# EAGLE design cover_pcb_2 (EAGLE 9.3.1)

## Sheet 1 of 2
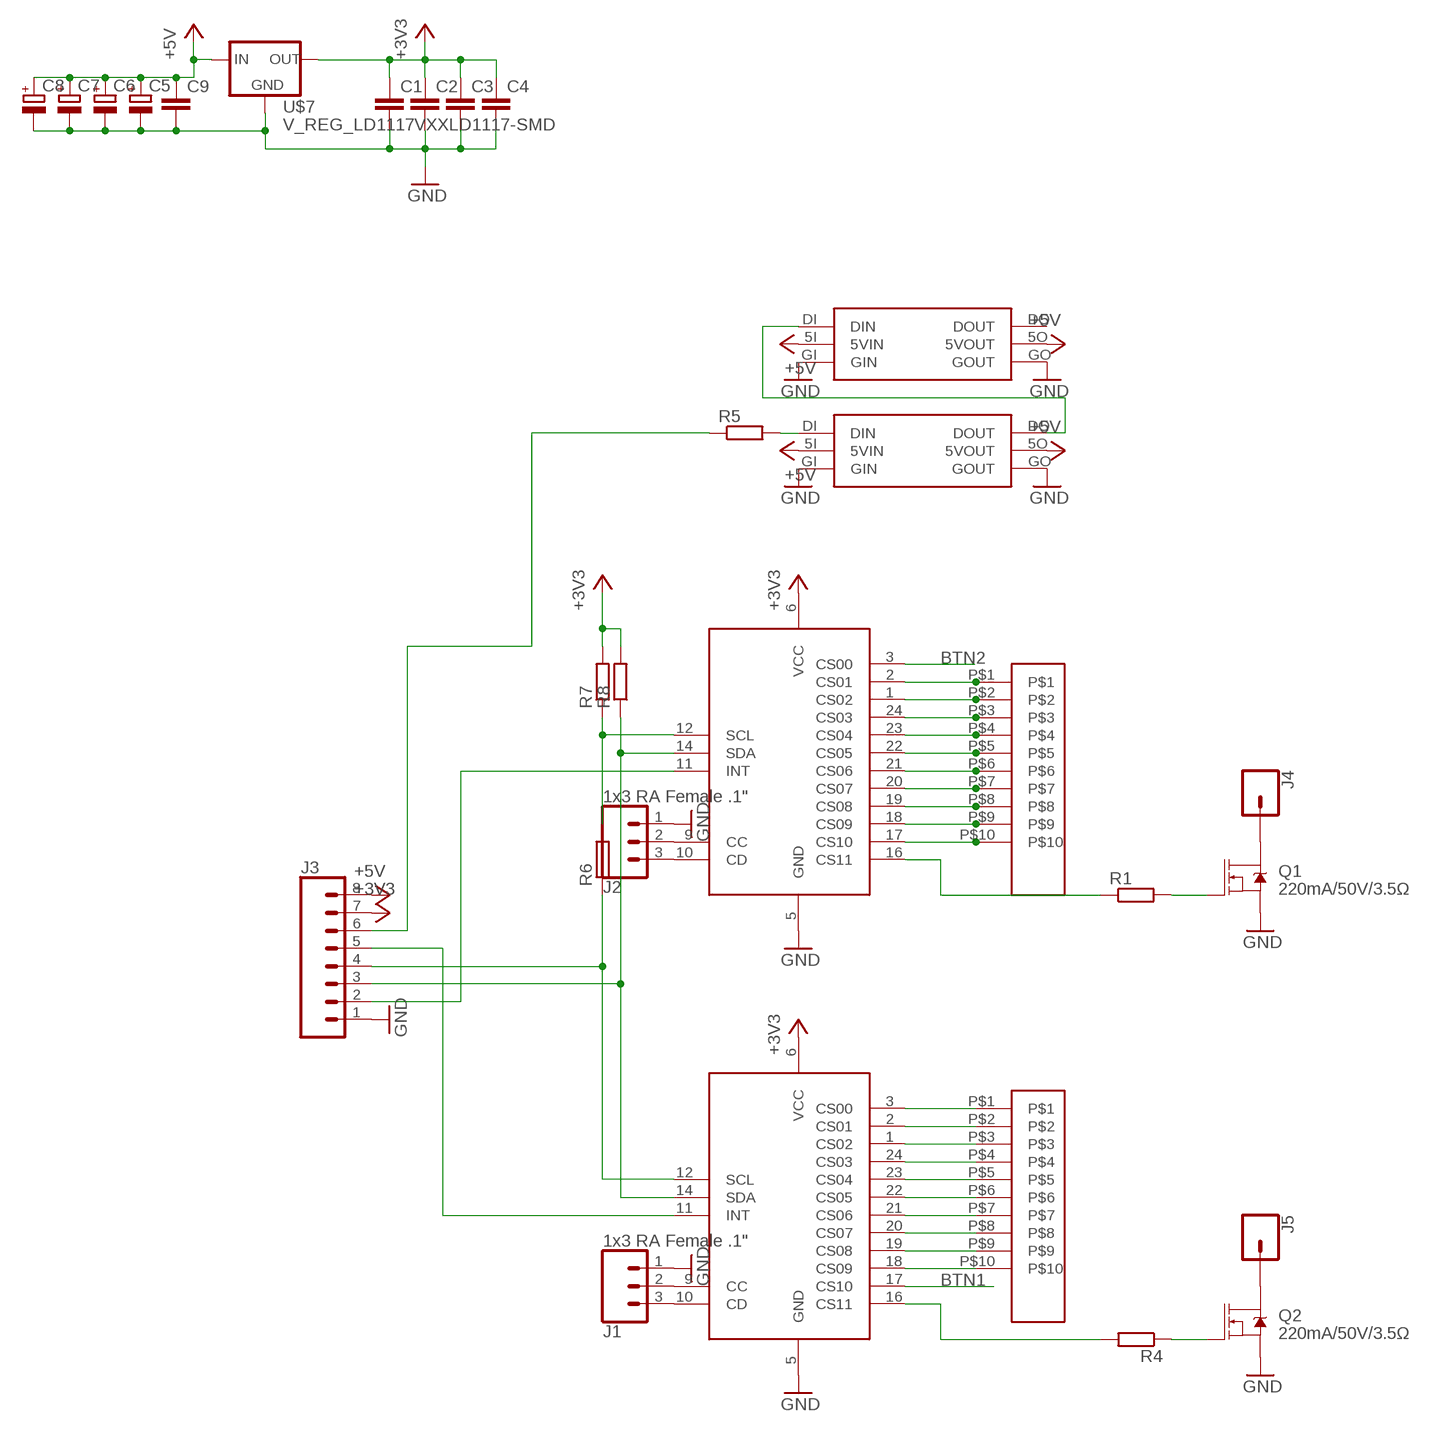
[diagram p0: schematic, sheet 1]

### Parts
C1  C-EUC0805K  [C0805K]
C2  C-EUC0805K  [C0805K]
C3  C-EUC0805K  [C0805K]
C4  C-EUC0805K  [C0805K]
C5  CPOL-EUSMCD  [SMC_D]
C6  CPOL-EUSMCD  [SMC_D]
C7  CPOL-EUSMCD  [SMC_D]
C8  CPOL-EUSMCD  [SMC_D]
C9  C-EUC0805K  [C0805K]
J1  1x3 RA Female .1"  CONN_03SMD_RA_FEMALE  [1X03_SMD_RA_FEMALE]
J2  1x3 RA Female .1"  CONN_03SMD_RA_FEMALE  [1X03_SMD_RA_FEMALE]
J3  CONN_08SMD-MALE  [1X08_SMD_MALE]
J4  CONN_01SPRING-CONN  [SPRING-CONNECTOR]
J5  CONN_01SPRING-CONN  [SPRING-CONNECTOR]
Q1  220mA/50V/3.5Ω  MOSFET-NCH-BSS138  [SOT23-3]
Q2  220mA/50V/3.5Ω  MOSFET-NCH-BSS138  [SOT23-3]
R1  R-EU_R0805  [R0805]
R4  R-EU_R0805  [R0805]
R5  R-EU_R0805  [R0805]
R6  R-EU_R0805  [R0805]
R7  R-EU_R0805  [R0805]
R8  R-EU_R0805  [R0805]
U$1  RGB6LED  [RGB6LED]
U$2  RGB6LED  [RGB6LED]
U$3  TOUCH10  [TOUCH10CM]
U$4  TOUCH10  [TOUCH10CM]
U$5  CP112S  [QSOP24]
U$6  CP112S  [QSOP24]
U$7  V_REG_LD1117VXXLD1117-SMD  [SOT223]

### Nets
+3V3: C1.1 C2.1 C3.1 C4.1 J3.7 R7.2 R8.2 U$5.6(VCC) U$6.6(VCC) U$7.2(OUT)
+5V: C5.+ C6.+ C7.+ C8.+ C9.1 J3.8 U$1.5I(5VIN) U$1.5O(5VOUT) U$2.5I(5VIN) U$2.5O(5VOUT) U$7.3(IN)
BTN1: U$6.17(CS10)
BTN2: U$5.3(CS00)
GND: C1.2 C2.2 C3.2 C4.2 C5.- C6.- C7.- C8.- C9.2 J1.1 J2.1 J3.1 Q1.2(S) Q2.2(S) U$1.GI(GIN) U$1.GO(GOUT) U$2.GI(GIN) U$2.GO(GOUT) U$5.5(GND) U$6.5(GND) U$7.1(GND) ; also sheet 2
N$2: U$3.P$1 U$5.2(CS01)
N$3: U$3.P$2 U$5.1(CS02)
N$4: U$3.P$3 U$5.24(CS03)
N$5: U$3.P$4 U$5.23(CS04)
N$6: U$3.P$5 U$5.22(CS05)
N$7: U$3.P$6 U$5.21(CS06)
N$8: U$3.P$7 U$5.20(CS07)
N$9: U$3.P$8 U$5.19(CS08)
N$10: U$3.P$9 U$5.18(CS09)
N$11: U$4.P$1 U$6.3(CS00)
N$12: U$4.P$2 U$6.2(CS01)
N$13: U$4.P$3 U$6.1(CS02)
N$14: U$4.P$4 U$6.24(CS03)
N$15: U$4.P$5 U$6.23(CS04)
N$16: U$4.P$6 U$6.22(CS05)
N$17: U$4.P$7 U$6.21(CS06)
N$18: U$4.P$8 U$6.20(CS07)
N$19: U$4.P$9 U$6.19(CS08)
N$20: U$4.P$10 U$6.18(CS09)
N$21: R6.2 R7.1 U$5.12(SCL)
N$22: J3.5 U$6.11(INT)
N$24: U$1.DI(DIN) U$2.DO(DOUT)
N$25: R1.1 U$5.16(CS11)
N$26: R4.2 U$6.16(CS11)
N$27: Q2.1(G) R4.1
N$28: J5.P$2 Q2.3(D)
N$29: R5.2 U$2.DI(DIN)
N$30: J3.6 R5.1
N$31: J3.3 R8.1 U$5.14(SDA) U$6.14(SDA)
N$32: J3.4 R6.1 U$6.12(SCL)
N$34: J3.2 U$5.11(INT)
N$35: J4.P$2 Q1.3(D)
N$36: J2.2 U$5.9(CC)
N$37: J2.3 U$5.10(CD)
N$38: J1.2 U$6.9(CC)
N$39: J1.3 U$6.10(CD)
N$40: Q1.1(G) R1.2
T1: U$3.P$10 U$5.17(CS10)
Unconnected: U$1.DO(DOUT)

## Sheet 2 of 2
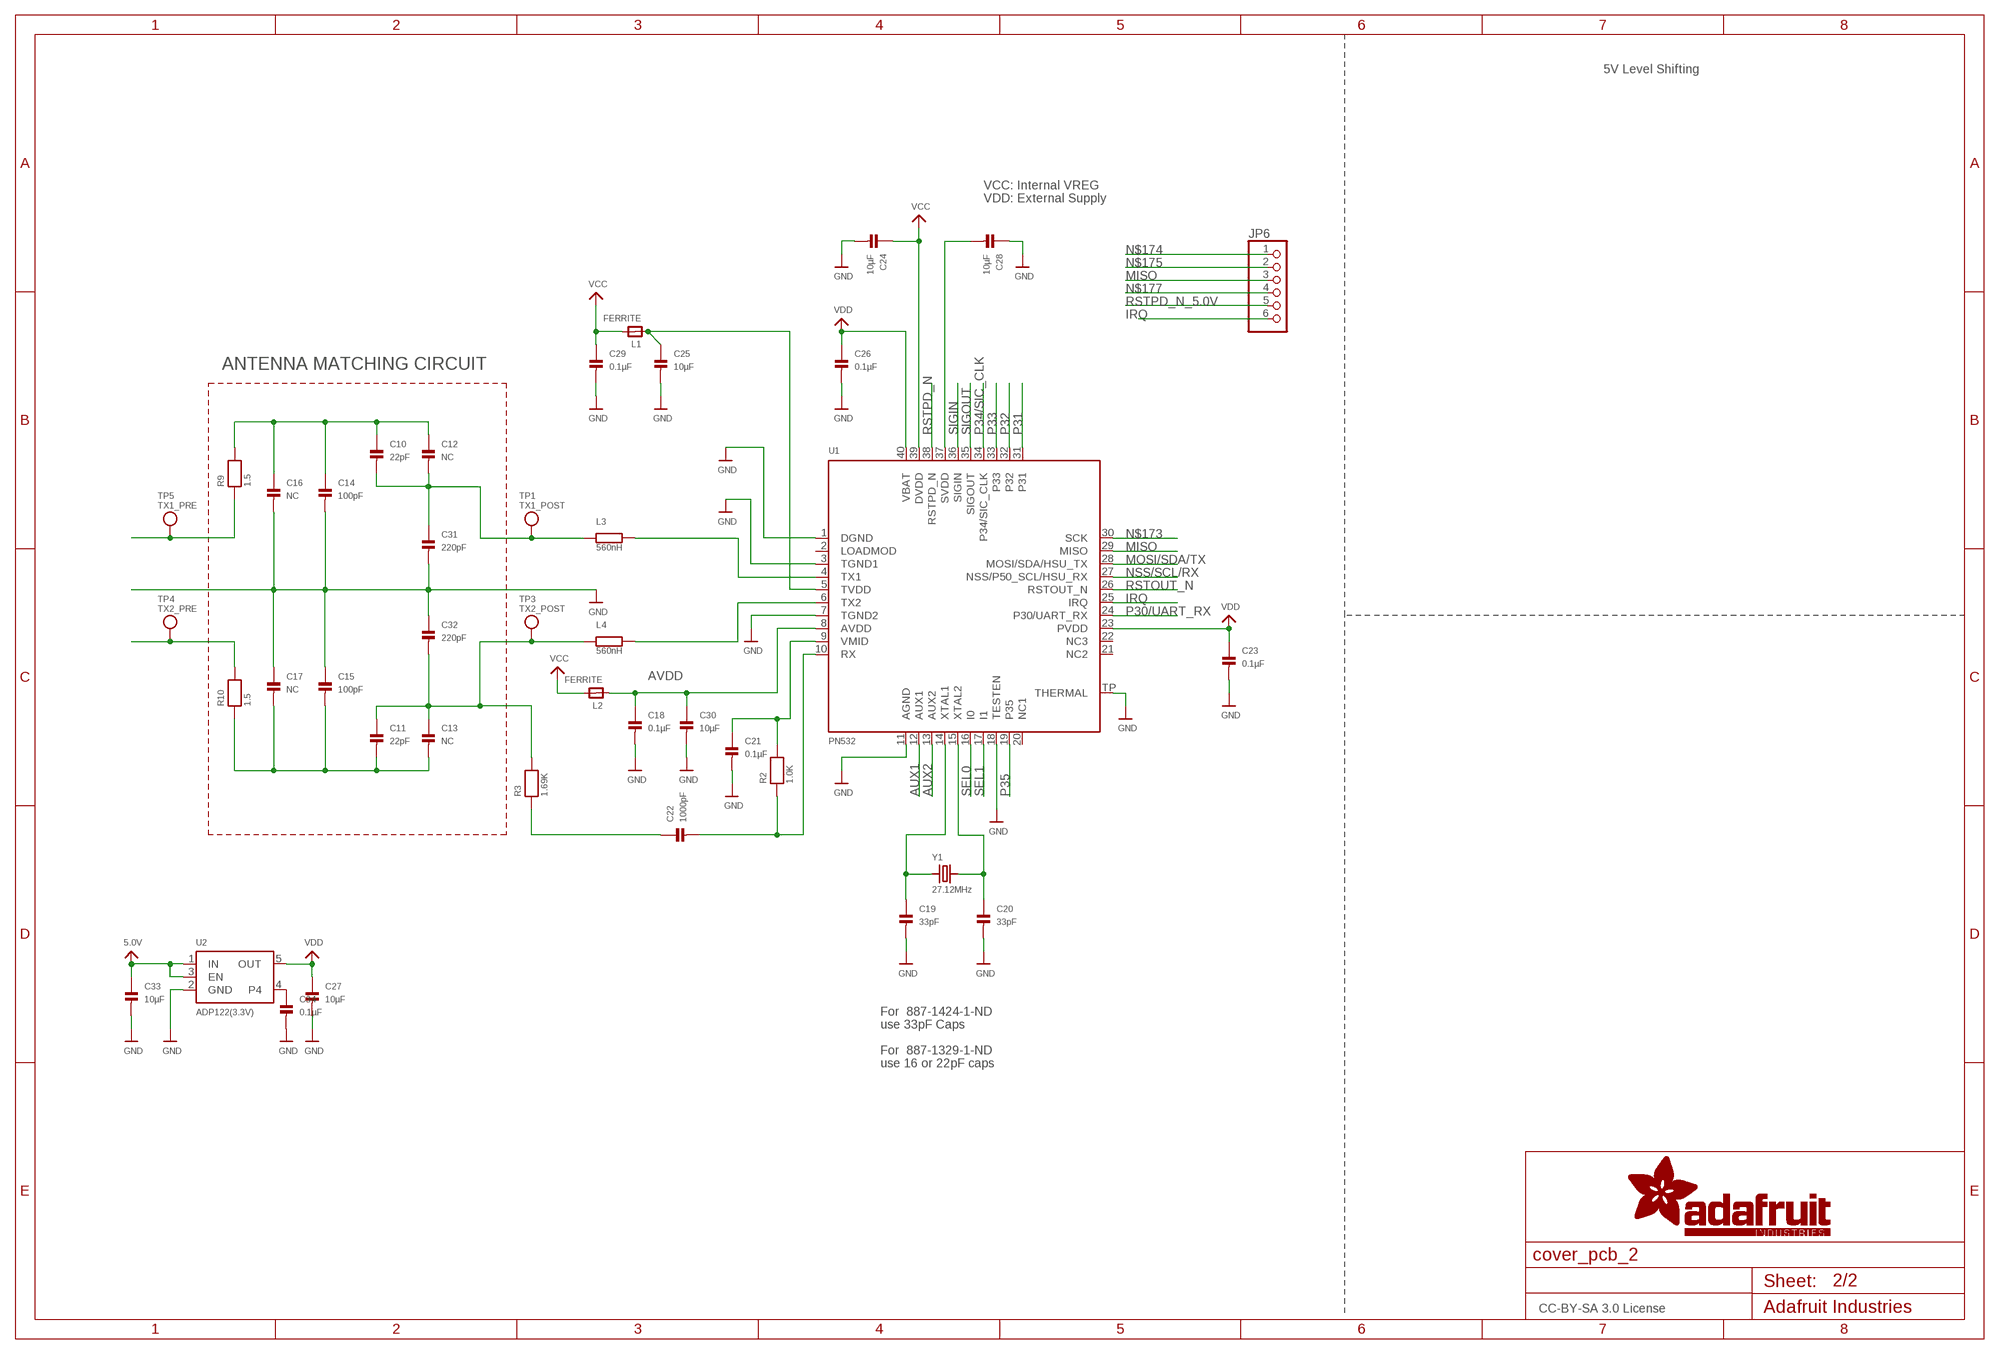
[diagram p1: schematic, sheet 2]

### Parts
C10  22pF  CAP_CERAMIC0805  [0805]
C11  22pF  CAP_CERAMIC0805  [0805]
C12  NC  CAP_CERAMIC0805  [0805]
C13  NC  CAP_CERAMIC0805  [0805]
C14  100pF  CAP_CERAMIC0805  [0805]
C15  100pF  CAP_CERAMIC0805  [0805]
C16  NC  CAP_CERAMIC0805  [0805]
C17  NC  CAP_CERAMIC0805  [0805]
C18  0.1µF  CAP_CERAMIC0805  [0805]
C19  33pF  CAP_CERAMIC0805  [0805]
C20  33pF  CAP_CERAMIC0805  [0805]
C21  0.1µF  CAP_CERAMIC0805  [0805]
C22  1000pF  CAP_CERAMIC0805  [0805]
C23  0.1µF  CAP_CERAMIC0805  [0805]
C24  10µF  CAP_CERAMIC0805  [0805]
C25  10µF  CAP_CERAMIC0805  [0805]
C26  0.1µF  CAP_CERAMIC0805  [0805]
C27  10µF  CAP_CERAMIC0805  [0805]
C28  10µF  CAP_CERAMIC0805  [0805]
C29  0.1µF  CAP_CERAMIC0805  [0805]
C30  10µF  CAP_CERAMIC0805  [0805]
C31  220pF  CAP_CERAMIC0805  [0805]
C32  220pF  CAP_CERAMIC0805  [0805]
C33  10µF  CAP_CERAMIC0805  [0805]
C34  0.1µF  CAP_CERAMIC0805  [0805]
JP6  PINHD-1X6B  [1X06-BIG]
L1  FERRITE  FERRITE0805  [0805]
L2  FERRITE  FERRITE0805  [0805]
L3  560nH  R-EU_R1206  [R1206]
L4  560nH  R-EU_R1206  [R1206]
R2  1.0K  RESISTOR0805  [0805]
R3  1.69K  RESISTOR0805  [0805]
R9  1.5  RESISTOR0805  [0805]
R10  1.5  RESISTOR0805  [0805]
TP1  TX1_POST  TESTPOINTPAD  [TESTPOINT_PAD_2MM]
TP3  TX2_POST  TESTPOINTPAD  [TESTPOINT_PAD_2MM]
TP4  TX2_PRE  TESTPOINTPAD  [TESTPOINT_PAD_2MM]
TP5  TX1_PRE  TESTPOINTPAD  [TESTPOINT_PAD_2MM]
U1  PN532  [HVQFN40-6X6]
U2  ADP122(3.3V)  VREG_SOT23-5  [SOT23-5]
Y1  27.12MHz  CRYSTAL3.2X2.5  [CRYSTAL_3.2X2.5]

### Nets
5.0V: C33.1 U2.1(IN) U2.3(EN)
AUX1: U1.12(AUX1)
AUX2: U1.13(AUX2)
AVDD: C18.1 C30.1 L2.1 U1.8(AVDD)
GND: C14.2 C15.1 C16.2 C17.1 C18.2 C19.2 C20.2 C21.2 C23.2 C24.2 C25.2 C26.2 C27.2 C28.1 C29.2 C30.2 C31.2 C32.1 C33.2 C34.2 U1.1(DGND) U1.3(TGND1) U1.7(TGND2) U1.11(AGND) U1.18(TESTEN) U1.TP(THERMAL) U2.2(GND) ; also sheet 1
IRQ: JP6.6 U1.25(IRQ)
MISO: JP6.3 U1.29(MISO)
MOSI/SDA/TX: U1.28(MOSI/SDA/HSU_TX)
N$44: L3.2 U1.4(TX1)
N$45: L4.2 U1.6(TX2)
N$46: C10.2 C12.2 C31.1 L3.1 TP1.P$1
N$47: C19.1 U1.14(XTAL1) Y1.1
N$48: C20.1 U1.15(XTAL2) Y1.2
N$49: C21.1 R2.2 U1.9(VMID)
N$50: C22.2 R2.1 U1.10(RX)
N$51: C22.1 R3.1
N$52: C11.1 C13.1 C32.2 L4.1 R3.2 TP3.P$1
N$53: R9.1 TP5.P$1
N$54: R10.2 TP4.P$1
N$56: C25.1 L1.1 U1.5(TVDD)
N$83: C34.1 U2.4
N$84: C28.2 U1.37(SVDD)
N$173: U1.30(SCK)
N$174: JP6.1
N$175: JP6.2
N$177: JP6.4
NSS/SCL/RX: U1.27(NSS/P50_SCL/HSU_RX)
P30/UART_RX: U1.24(P30/UART_RX)
P31: U1.31
P32: U1.32
P33: U1.33
P34/SIC_CLK: U1.34(P34/SIC_CLK)
P35: U1.19(P35)
RSTOUT_N: U1.26(RSTOUT_N)
RSTPD_N: U1.38(RSTPD_N)
RSTPD_N_5.0V: JP6.5
SEL0: U1.16(I0)
SEL1: U1.17(I1)
SIGIN: U1.36(SIGIN)
SIGOUT: U1.35(SIGOUT)
TX1_ANTENNA: C10.1 C12.1 C14.1 C16.1 R9.2
TX2_ANTENNA: C11.2 C13.2 C15.2 C17.2 R10.1
VCC: C24.1 C29.1 L1.2 L2.2 U1.39(DVDD)
VDD: C23.1 C26.1 C27.1 U1.23(PVDD) U1.40(VBAT) U2.5(OUT)
Unconnected: U1.2(LOADMOD) U1.20(NC1) U1.21(NC2) U1.22(NC3)

### Notes on the sheet
- 5V Level Shifting
- VCC: Internal VREG
- VDD: External Supply
- ANTENNA MATCHING CIRCUIT
- For  887-1424-1-ND
- use 33pF Caps
- For  887-1329-1-ND
- use 16 or 22pF caps
- CC-BY-SA 3.0 License

## Library data of the parts
C1-C4 C9 = rcl:C-EU: CAPACITOR, European symbol; SPICEPREFIX: C
C5-C8 = rcl:CPOL-EU: POLARIZED CAPACITOR, European symbol; SPICEPREFIX: C
C10-C34 = microbuilder:CAP_CERAMIC: Ceramic Capacitors 0402 - 0402 Surface Mount Capacitors 16pF 50V 5% [Digikey: 445-4899-2-ND] 18pF 50V 5% [Digikey: 490-1281-2-ND] 22pF 50V 5% [Digikey: 490-1283-2-ND] 68pF 50V 5% [Digikey: 490-1289-2-ND] 0.1uF 10V 10% [Digikey: 490-1318-2-ND] 1.0uF 6.3V 10% [Digikey: 490-1320-2-ND] 0603 - 0603 Surface Mount Capacitors 16 pF 50V 5% [Digikey: 445-5051-2-ND] 22 pF 50V [Digikey: PCC220ACVTR-ND] 33 pF 50V 5% [Digikey: 490-1415-1-ND] 56pF 50V 5% [Digikey: 490-1421-1-ND] 220pF 50V 5% [Digikey: 445-1285-1-ND] 680 pF 50V 2200 pF 50V 5% C0G [Digikey: 445-1297-1-ND] 5600 pF 100V 5% X7R [Digikey: 478-3711-1-ND] 0.1 µF 25V 10% [Digikey: PCC2277TR-ND] 0.22 µF 16V 10% X7R [Digikey: 445-1318-1-ND] 1.0 µF 25V 10% [Digikey: 445-5146-2-ND] 0603 - RF Specific 3pF 250V +/-0.1pF RF [Digikey: 712-1347-1-ND] 18 pF 250V 5% [Digikey: 478-3505-1-ND or 712-1322-1-ND] 56 pF 250V 5% C0G RF [Digikey: 490-4867-1-ND] 68 pF 250V RF [Digikey: 490-4868-1-ND] 0805 - 0805 Surface Mount Capacitors 220 pF 250V 2% RF Ceramic Capacitor [Digikey: 712-1398-1-ND] 1000 pF 50V 2% NP0 Ceramic Capacitor [Digikey: 478-3760-1-ND] 0.1 µF 25V 10% Ceramic Capacitor [Digikey: PCC1828TR-ND] 1.0 µF 16V 10% Ceramic Capacitor[Digikey: 490-1691-2-ND] 10.0 µF 10V 10% Ceramic Capacitor[Digikey: 709-1228-1-ND] 10.0 uF 16V 10% Ceramic Capacitor [Digikey: 478-5165-2-ND] 47 uF 6.3V 20% Ceramic Capacitor [Digikey: 587-1779-1-ND or 399-5506-1-ND] 1206 - 1206 Surface Mount Capacitors 47uF 10V 20% Ceramic Capacitor [Digikey: 490-5528-1-ND or 399-5508-1-ND or 445-6010-1-ND] 100uF 6.3V -20%, +80% Y5V Ceramic Capacitor (Digikey: 490-4512-1-ND, Mouser: 81-GRM31CF50J107ZE1L)
J1 J2 = SparkFun-Connectors:CONN_03: Multi connection point. Often used as Generic Header-pin footprint for 0.1 inch spaced/style header connections On any of the 0.1 inch spaced packages, you can populate with these: Break Away Headers - Straight <https://www.sparkfun.com/products/116> (PRT-00116) Break Away Male Headers - Right Angle <https://www.sparkfun.com/products/553> (PRT-00553) Female Headers <https://www.sparkfun.com/products/115> (PRT-00115) Break Away Headers - Machine Pin <https://www.sparkfun.com/products/117> (PRT-00117) Break Away Female Headers - Swiss Machine Pin <https://www.sparkfun.com/products/743> (PRT-00743) Stackable Header - 3 Pin (Female, 0.1") <https://www.sparkfun.com/products/13875> (PRT-13875) For SCREWTERMINALS and SPRING TERMINALS visit here: Screw Terimnals on SparkFun.com <https://www.sparkfun.com/search/results?term=Screw+Terminals> (5mm/3.5mm/2.54mm spacing) This device is also useful as a general connection point to wire up your design to another part of your project. Our various solder wires solder well into these plated through hole pads. Hook-Up Wire - Assortment (Stranded, 22 AWG) <https://www.sparkfun.com/products/11375> (PRT-11375) Hook-Up Wire - Assortment (Solid Core, 22 AWG) <https://www.sparkfun.com/products/11367> (PRT-11367) View the entire wire category on our website here <https://www.sparkfun.com/categories/141> Special notes: Molex polarized connector foot print use with SKU : PRT-08232 with associated crimp pins and housings.; PROD_ID: CONN-10926
J3 = SparkFun-Connectors:CONN_08: Multi connection point. Often used as Generic Header-pin footprint for 0.1 inch spaced/style header connections On any of the 0.1 inch spaced packages, you can populate with these: Break Away Headers - Straight <https://www.sparkfun.com/products/116> (PRT-00116) Break Away Male Headers - Right Angle <https://www.sparkfun.com/products/553> (PRT-00553) Female Headers <https://www.sparkfun.com/products/115> (PRT-00115) Break Away Headers - Machine Pin <https://www.sparkfun.com/products/117> (PRT-00117) Break Away Female Headers - Swiss Machine Pin <https://www.sparkfun.com/products/743> (PRT-00743) Arduino Stackable Header - 8 Pin <https://www.sparkfun.com/products/9279> (PRT-09279) For SCREWTERMINALS and SPRING TERMINALS visit here: Screw Terimnals on SparkFun.com <https://www.sparkfun.com/search/results?term=Screw+Terminals> (5mm/3.5mm/2.54mm spacing) This device is also useful as a general connection point to wire up your design to another part of your project. Our various solder wires solder well into these plated through hole pads. Hook-Up Wire - Assortment (Stranded, 22 AWG) <https://www.sparkfun.com/products/11375> (PRT-11375) Hook-Up Wire - Assortment (Solid Core, 22 AWG) <https://www.sparkfun.com/products/11367> (PRT-11367) View the entire wire category on our website here <https://www.sparkfun.com/categories/141> Special notes: Molex polarized connector foot print use with SKU : PRT-08231 with associated crimp pins and housings. 1MM SMD Version SKU: PRT-10208 NOTES ON THE VARIANTS LOCK and LOCK_LONGPADS... This footprint was designed to help hold the alignment of a through-hole component (i.e. 6-pin header) while soldering it into place. You may notice that each hole has been shifted either up or down by 0.005 of an inch from it's more standard position (which is a perfectly straight line). This slight alteration caused the pins (the squares in the middle) to touch the edges of the holes. Because they are alternating, it causes a "brace" to hold the component in place. 0.005 has proven to be the perfect amount of "off-center" position when using our standard breakaway headers. Although looks a little odd when you look at the bare footprint, once you have a header in there, the alteration is very hard to notice. Also,if you push a header all the way into place, it is covered up entirely on the bottom side.; PROD_ID: CONN-11292; SF_ID: PRT-11541
J4 J5 = SparkFun-Connectors:CONN_01: Single connection point. Often used as Generic Header-pin footprint for 0.1 inch spaced/style header connections On any of the 0.1 inch spaced packages, you can populate with these: Break Away Headers - Straight <https://www.sparkfun.com/products/116> (PRT-00116) Break Away Male Headers - Right Angle <https://www.sparkfun.com/products/553> (PRT-00553) Female Headers <https://www.sparkfun.com/products/115> (PRT-00115) Break Away Headers - Machine Pin <https://www.sparkfun.com/products/117> (PRT-00117) Break Away Female Headers - Swiss Machine Pin <https://www.sparkfun.com/products/743> (PRT-00743) This device is also useful as a general connection point to wire up your design to another part of your project. Our various solder wires solder well into these plated through hole pads. Hook-Up Wire - Assortment (Stranded, 22 AWG) <https://www.sparkfun.com/products/11375> (PRT-11375) Hook-Up Wire - Assortment (Solid Core, 22 AWG) <https://www.sparkfun.com/products/11367> (PRT-11367) View the entire wire category on our website here <https://www.sparkfun.com/categories/141> Special notes: SMTSO-256-ET is a "flush mount" nut for a 4-40 screw. We mostly use this on specialty testbeds; it is a nice way to connect hardware to your PCB at an adjustable hieght. Also note, the SNAP packages are for using a snappable style connector. We sell a baggie of snaps and they are also used on two LilyPad designs: Snap Assortment - 30 pack (male and female) <https://www.sparkfun.com/products/11347> (DEV-11347) LilyPad Arduino SimpleSnap <https://www.sparkfun.com/products/10941> (DEV-10941) LilyPad SimpleSnap Protoboard <https://www.sparkfun.com/products/10940> (DEV-10940); SF_ID: PRT-11822
JP6 = adafruit:PINHD-1X6: PIN HEADER
L1 L2 = microbuilder:FERRITE: Ferrite Bead 0603 MMZ1608B121C - 120 Ohm @ 100MHz, 600mA, 0.15 Ohm DC Resistance - Digikey: 445-2164-1-ND BK1608HW121-T - 120 Ohm, 600mA Ferrite Chip - Digikey: 587-1876-2-ND 0805 HZ0805B272R-10 - 2.7K Ohm @ 100MHz, 200mA, 0.8 Ohm DC Resistance - Digikey: 240-2504-1-ND (see also Murata BLM21BD272SN1L) MMZ2012Y152B - 1.5K Ohm @ 100MHz, 500mA, 0.4 Ohm DC Resistance - Digikey: 445-1560-1-ND - Mainly for high frequency (80-400MHz) MMZ2012R102A - 1K Ohm @ 100MHz, 500mA, 0.3 Ohm DC Resistance - Digikey: 445-1555-2-ND - More general purpose (10-200MHz)
L3 L4 R1 R4-R8 = rcl:R-EU_: RESISTOR, European symbol; SPICEPREFIX: R
Q1 Q2 = SparkFun-DiscreteSemi:MOSFET-NCH: N-channel MOSFETs Voltage controlled devices that allow control of high current outputs. SparkFun Products: SparkFun OpenScale <https://www.sparkfun.com/products/13261> SparkFun Digital Sandbox <https://www.sparkfun.com/products/12651> SparkFun Monster Moto Shield <https://www.sparkfun.com/products/10182> SparkFun MOSFET Power Controller <https://www.sparkfun.com/products/11214>; PROD_ID: TRANS-00830
R2 R3 R9 R10 = microbuilder:RESISTOR: Resistors 0402 - 0402 Surface Mount Package 22 Ohm 1% 1/16W [Digikey: 311-22.0LRTR-ND] 33 Ohm 5% 1/16W 1.0K 5% 1/16W 1.5K 5% 1/16W 2.0K 1% 1/16W 10.0K 1% 1/16W [Digikey: 311-10.0KLRTR-ND] 10.0K 5% 1/16W [Digikey: RMCF0402JT10K0TR-ND] 12.1K 1% 1/16W [Digikey: 311-22.0LRTR-ND] 100.0K 5% 1/16W 0603 - 0603 Surface Mount Package 0 Ohm 1/10 Watt 1% Resistor 15 Ohm 1/10 Watt 1% Resistor 33 Ohm 1/10 Watt 1% Resistor 49.9 Ohm 1/10 Watt 1% Resistor 100 Ohm 1/10 Watt 1% Resistor 150 Ohm 1/10 Watt 1% Resistor 240 Ohm 1/10 Watt 1% Resistor 390 Ohm 1/10 Watt 1% Resistor 560 Ohm 1/10 Watt 1% Resistor 680 Ohm 1/10 Watt 1% Resistor 750 Ohm 1/10 Watt 1% Resistor 1.0K Ohm 1/10 Watt 1% Resistor 1.5K Ohm 1/10 Watt 1% Resistor 2.0K Ohm 1/10 Watt 1% Resistor 2.2K Ohm 1/10 Watt 1% Resistor 3.3K Ohm 1/10 Watt 1% Resistor 4.7K Ohm 1/10 Watt 1% Resistor 10.0K Ohm 1/10 Watt 1% Resistor 12.0K Ohm 1/10 Watt 1% Resistor 12.1K Ohm 1/10 Watt 1% Resistor 20.0K Ohm 1/10 Watt 1% Resistor 33.0K Ohm 1/10 Watt 1% Resistor 100.0K Ohm 1/10 Watt 1% Resistor 0805 - 0805 Surface Mount Package 0 Ohm 1/8 Watt 1% Resistor 33 Ohm 1/8 Watt 1% Resistor 100 Ohm 1/8 Watt 1% Resistor 150 Ohm 1/8 Watt 1% Resistor 200 Ohm 1/8 Watt 1% Resistor 240 Ohm 1/8 Watt 1% Resistor 330 Ohm 1/8 Watt 1% Resistor 390 Ohm 1/8 Watt 1% Resistor 470 Ohm 1/8 Watt 1% Resistor 1.0K Ohm 1/8 Watt 1% Resistor 1.5K Ohm 1/8 Watt 1% Resistor 2.0K Ohm 1/8 Watt 1% Resistor 4.7K Ohm 1/8 Watt 1% Resistor 5.1K Ohm 1/8 Watt 1% Resistor 5.6K Ohm 1/8 Watt 1% Resistor 10.0K Ohm 1/8 Watt 1% Resistor 22.0K Ohm 1/8 Watt 1% Resistor 33.0K Ohm 1/8 Watt 1% Resistor 100K Ohm 1/8 Watt 1% Resistor 1206 - 1206 Surface Mount Package 2012 - 2010 Surface Mount Package 0.11 Ohm 1/2 Watt 1% Resistor - Digikey: RHM.11UCT-ND
TP1 TP3-TP5 = microbuilder:TESTPOINT: Test Point Various test points for characterisation and PCB testing TESTPOINT_SMT - Compact Surface Mount Test Point [Digikey: 5016KTR-ND]
U1 = microbuilder:PN532: PN532 - Near Field Communication (NFC) controller Highly integrated transceiver module for contactless communication at 13.56 MHz (14443A/MIFARE, FeliCa, I4443B)
U2 = microbuilder:VREG_SOT23-5: SOT23-5 Fixed Voltage Regulators Part Current Out V Out V In V Dropout θJA (°C/W) TJ (°C) Digikey Part No. ADP121 150mA 3.3V 3.4-5.5V 0.09V @ 150mA -- -- ADP121-AUJZ33R7CT-ND ADP121 150mA 3.0V 3.1-5.5V 0.09V @ 150mA -- -- ADP121-AUJZ30R7CT-ND ADP122 300mA 3.3V 3.4-5.5V 0.085V @ 300mA -- -- ADP122AUJZ-3.3-R7CT-ND ADP1712 300mA 3.3V 3.5-5.5V 0.17V @ 300mA -- -- ADP1712AUJZ-3.3-R7TR-ND AP7311 (Low Cost) 150mA 3.3V 3.5-6V 0.15V @ 150mA -- -- AP7311-33WG-7DICT-ND LD39015M18R 150mA 1.8V 1.9V-5.5V 0.08V @ 100mA -- -- 497-6977-1-ND LP2985A-33DBVR 150mA 3.3V 3.3-16V 0.28V @ 150mA 206 150 296-18479-1-ND MCP1824T-3302E/OT 300mA 3.3V 3.5V-6V 0.2V @ 300mA -- -- MCP1824T-3302E/OTCT-ND MIC5205-2.5YM5 TR 150mA 2.5V 2.7-16V 0.165V @ 150mA -- -- 576-1257-2-ND MIC5205-3.0YM5 TR 150mA 3.0V 3.2V-16V 0.165V @ 150mA -- -- 576-1258-2-ND MIC5205-3.3YM5 TR 150mA 3.3V 3.5V-16V 0.165V @ 150mA -- -- 576-1259-2-ND TPS780330220 150mA 3.3V+2.2V 3.6-5.5V 250mV Max -- -- 296-23332-1-ND TDA3663/N1,135 100mA 3.3V 3.5-45V 0.18V @ 50mA -- -- 568-5343-1-ND Max operating temp can be calculated using θJA, TJ (max junction temperature), and power in watts. Set the "Maximum Ambient Temperature" until it reaches TJ ("Max Junction Temperature"), which is the absolute limit for safe use of the regulator: Heat Sink Temperature Calculator <http://www.daycounter.com/Calculators/Heat-Sink-Temperature-Calculator.phtml> For example, With 12V source into a 3.3V LP2985 and a 30mA load, we are dissipating (12V-3.3V) * 0.03A = 0.261W. With a θJA of 206 °C/W, a TJ of 150°C, and 261mW we can safely use the chip without a heat sink up to 75°C (=147.1°C Junction Temperature).
U$1 U$2 = mastrogippo:RGB6LED
U$3 U$4 = mastrogippo:TOUCH10
U$5 U$6 = mastrogippo:CP112S
U$7 = SparkFun-IC-Power:V_REG_LD1117VXX: LD1117VXX voltage regulator. We carry the 3.3V version (COM-00526) in TO-220 package.; PROD_ID: VREG-13917
Y1 = microbuilder:CRYSTAL: Crystals HC49UP - Surface Mount Crystal 4.0MHz 18pF +/-30ppm Surface Mount Crystal [Digikey: 535-9857-1-ND] 12.0 MHz Surface Mount Crystal [Digikey: 535-9869-6-ND] 25.0 MHz Surface Mount Crystal [Digikey: 535-9078-1-ND] 2.5 x 2.0mm - MEMs SMT Crystal 16.0 MHz 10pF 20ppm 2.5 x 2.0mm Crystal [Digikey -40-85°C: 535-10923-1-ND] 3.2 x 2.5mm - MEMs SMT Crystal 12.0 MHz 8pF 15ppm 3.2 x 2.5mm Crystal [Digikey: -10-70°C: 644-1047-1-ND -40-125°C: 644-1128-1-ND] 16.0 MHz 8pF 15ppm 3.2 x 2.5mm Crystal [Digikey: -10-70°C: 644-1049-1-ND -40-125°C: 644-1129-2-ND] 16.0 MHz 10pF 10ppm 3.2 x 2.5mm Crystal [Digikey: 644-1100-1-ND] 27.12 MHz 18pF 30ppm 3.2 x 2.5mm Crystal [Digikey: 887-1424-1-ND] 27.12MHz 10pF 10ppm 3.2 x 2.5mm Crystal [Digikey: 887-1329-1-ND] 4.9 x 1.8mm - MEMs SMT Crystal 32.768 KHz 12.5pF 20ppm 4.9 x 1.8mm Crystal [Digikey: SE2415CT-ND] 8.0 x 3.8mm - Surface Mount Crystal 32.768kHz 12.5pF 20ppm -40°C-85°C [Digikey: 535-9166-2-ND] Cylinder 32.768KHz Cylinder Crystal (2x6mm body) [Ex. Digikey: 300-8341-2-ND]

## Board
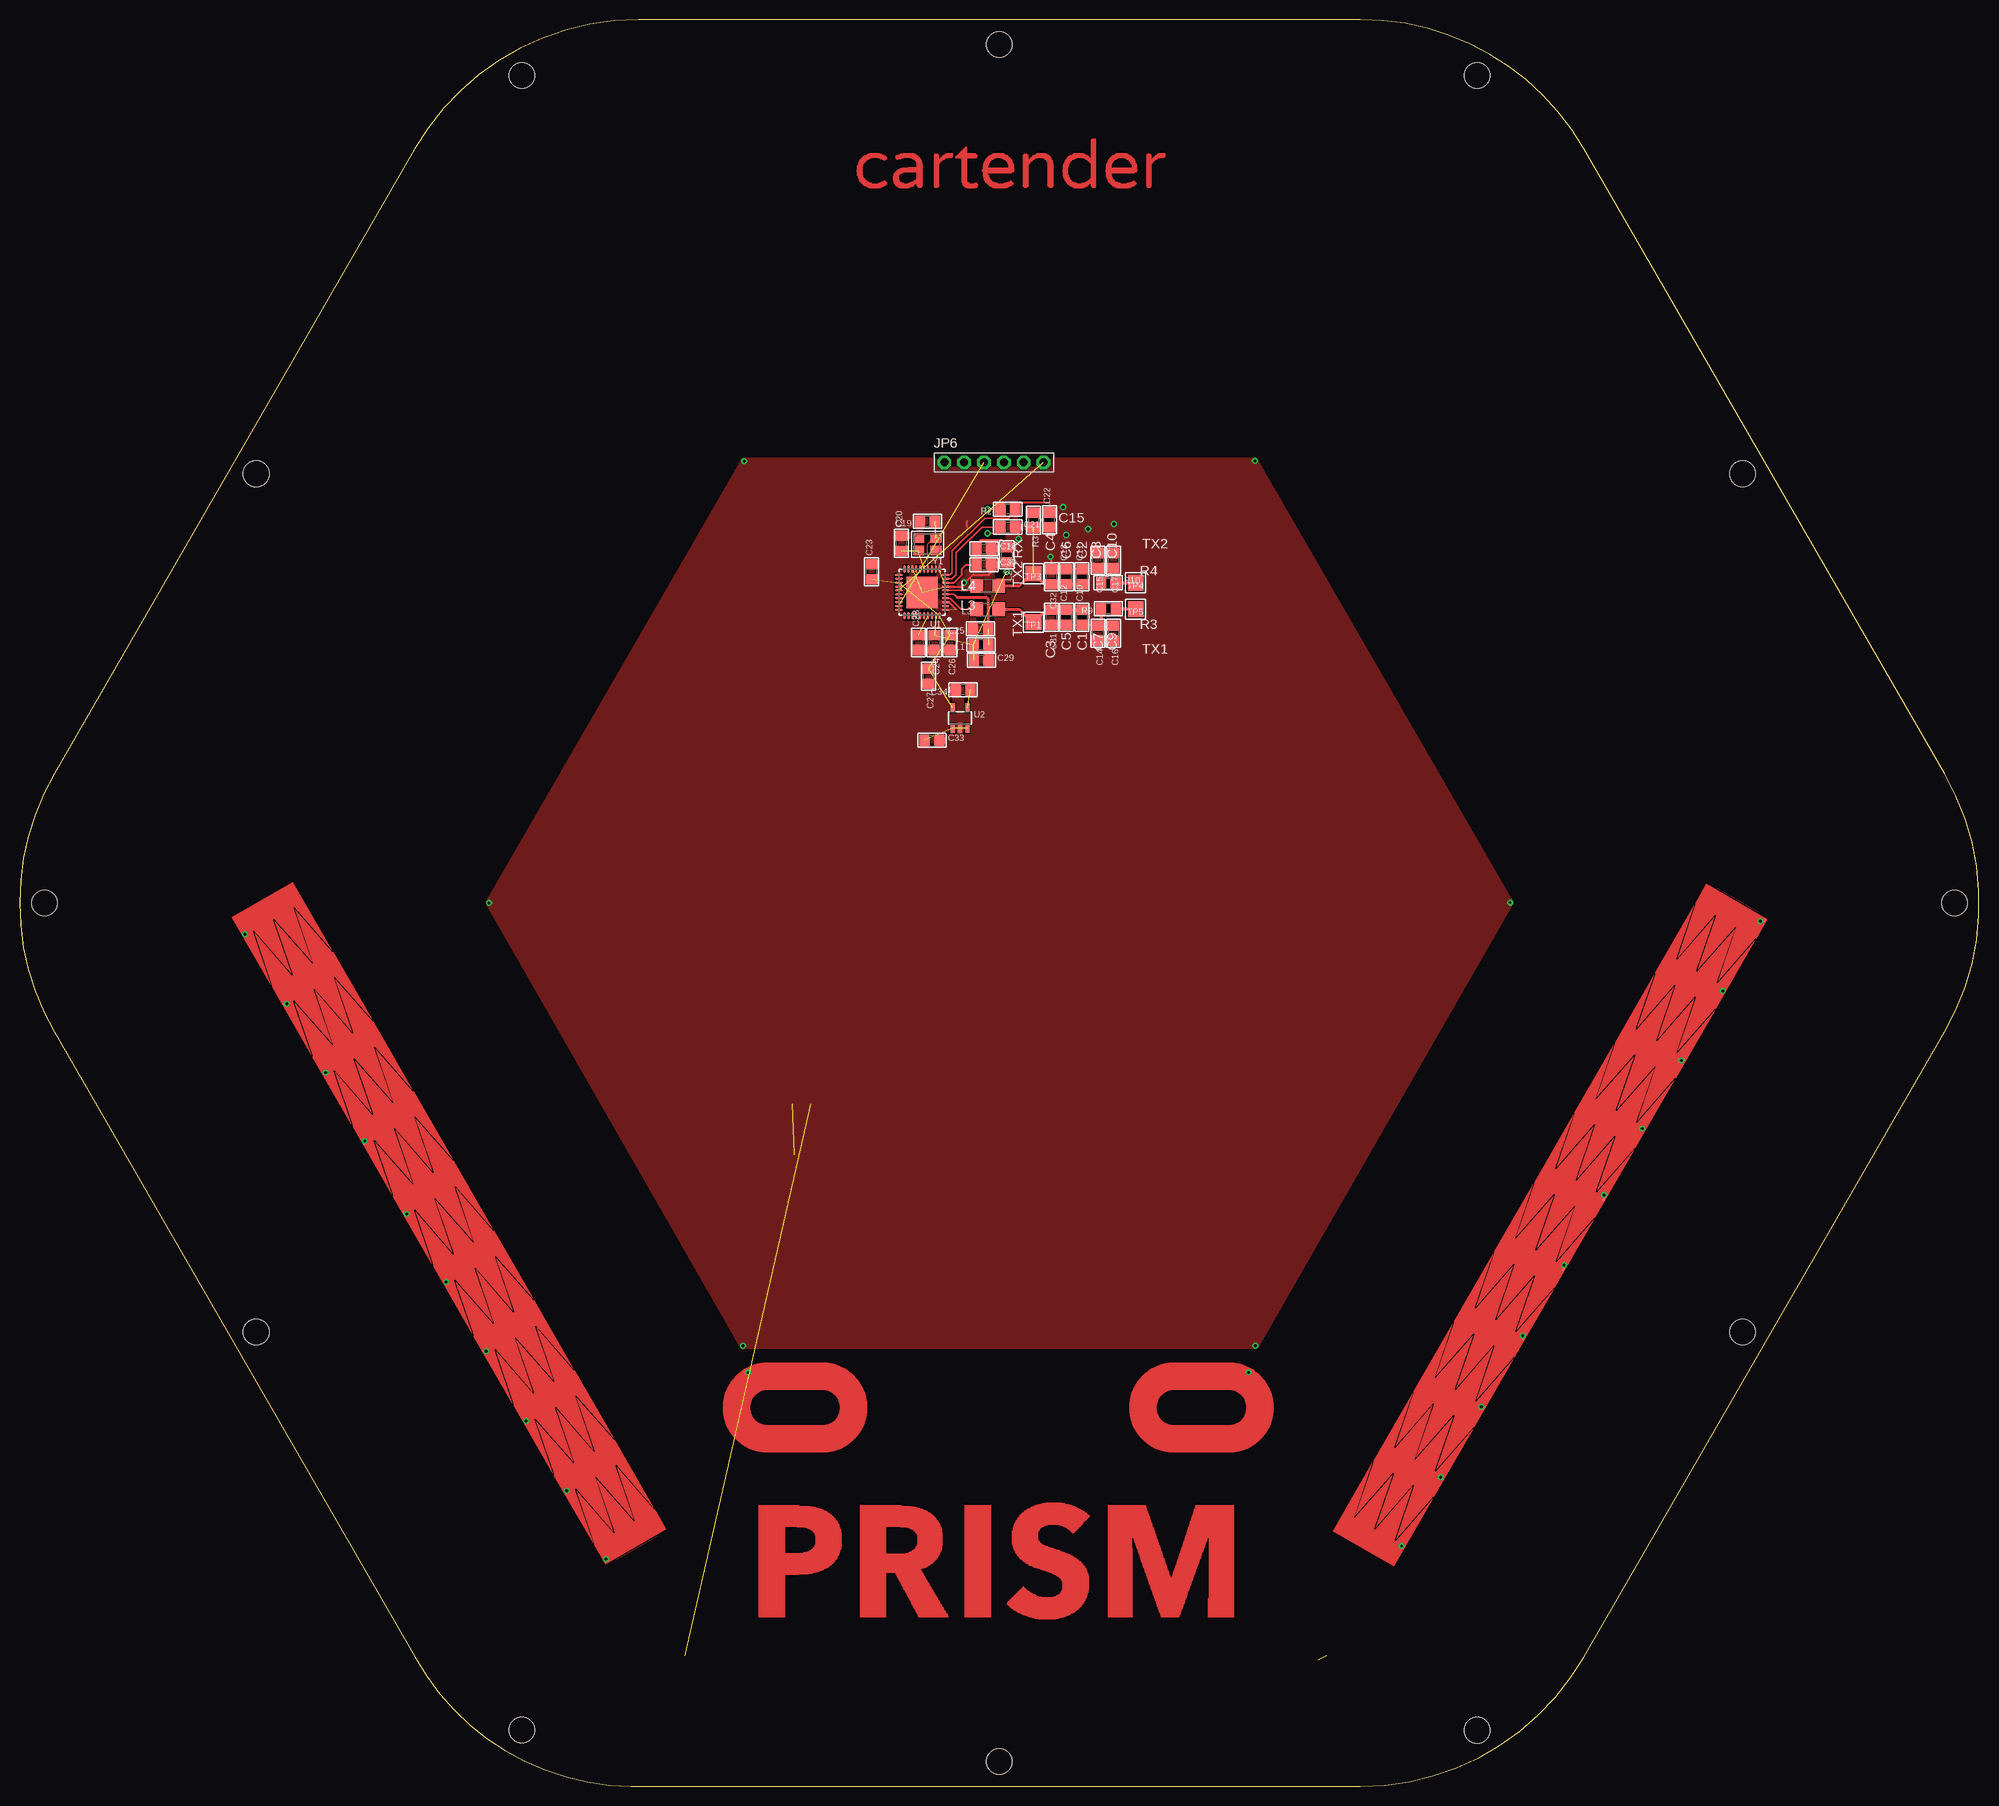
[diagram p2: board, top side]
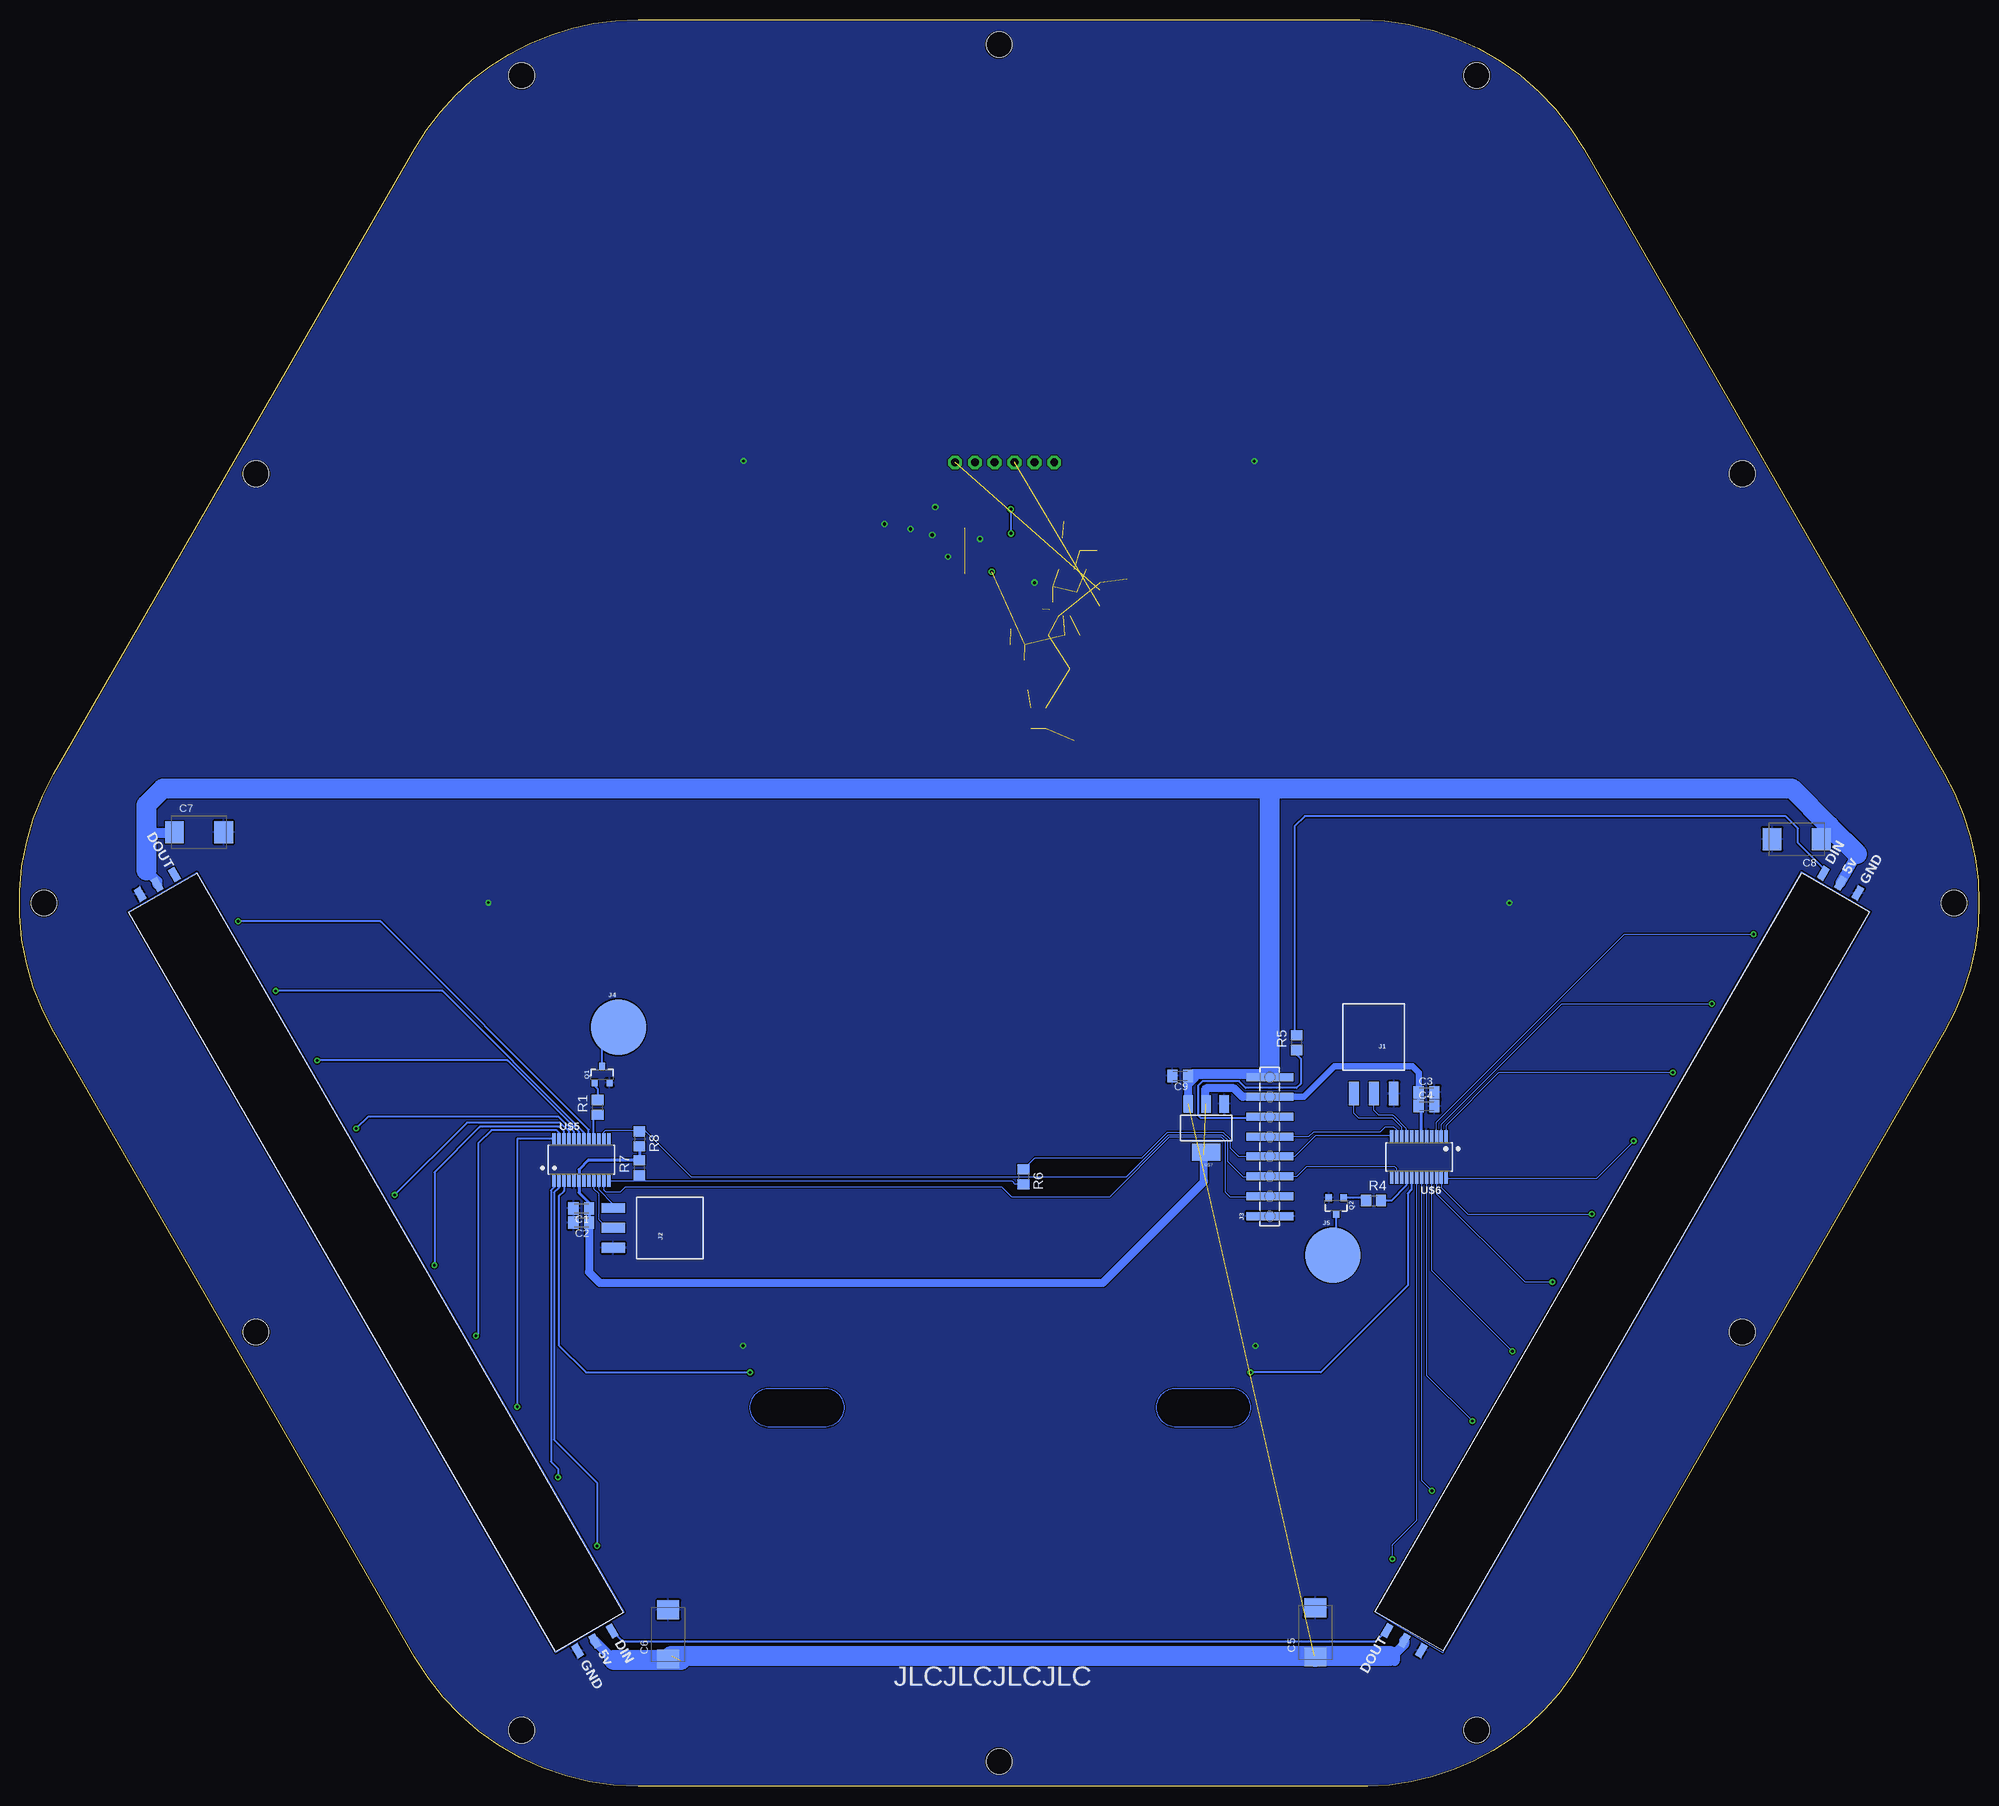
[diagram p3: board, bottom side, seen from below]

Size 250.71 x 226 mm. Coordinates in mm from the lower left corner, seen from the top.
Outline: 200.16,16.52 246.33,96.51 arc60 246.33,129.5 200.14,209.5 arc60 171.56,226 79.19,226 arc60 50.58,209.46 4.42,129.5 arc60 4.42,96.51 50.61,16.5 arc60 78.22,0 171.56,0.01 arc60 200.16,16.52
Copper layers (1*16): Top 0.035mm / dielectric 1.5mm / Bottom 0.035mm
Design rules "default *": minimum track width 6mil, minimum drill 0.35mm, track to track 6mil, track to pad 6mil, pad to pad 6mil, via to via 6mil, smd to smd 6mil, copper to edge 6mil, drill to drill 6mil, minimum pad ring 10mil, minimum via ring 8mil, stop-mask expansion 4mil, vias tented up to drill 60mil, thermal gap 10mil
Holes 3.3 mm at 186.48,7.17 64.28,7.18 64.28,218.84 186.48,218.83 3.18,113 30.28,167.9 125.38,222.8 247.58,113 220.48,58.1 125.38,3.2 220.48,167.9 30.28,58.1
tRestrict: area 118.2,150.2 to 118.8,150.3; area 117.5,152.5 to 117.8,153; area 115.3,150.4 to 115.8,150.7; area 113.2,152.5 to 113.5,153; area 115,154.7 to 116,155

### Footprints (pad centres in the part's own frame; a part is rotated, then mirrored left to right if it is on the bottom)
C0805K = smd 1.3 x 1.6: 1 -1,0; 2 1,0
SMC_D = smd 2.4 x 2.8: + -3.15,0; - 3.15,0
0805 = smd 1.3 x 1.5: 1 -0.95,0; 2 0.95,0
1X03_SMD_RA_FEMALE = smd 1.25 x 3: 1 -2.54,7.225; 2 0,7.225; 3 2.54,7.225
1X08_SMD_MALE = smd 1.02 x 6: 1 0,0; 2 2.54,0; 3 5.08,0; 4 7.62,0; 5 10.16,0; 6 12.7,0; 7 15.24,0; 8 17.78,0
SPRING-CONNECTOR = smd 7.112 x 7.112: P$2 0,0
1X06-BIG = drill 1.016 pad 1.778 octagon: 1 -6.35,0; 2 -3.81,0; 3 -1.27,0; 4 1.27,0; 5 3.81,0; 6 6.35,0
R1206 = smd 1.6 x 1.803: 1 -1.422,0; 2 1.422,0
SOT23-3 = smd 0.8 x 0.9: 1 -0.95,-1; 2 0.95,-1; 3 0,1.1
R0805 = smd 1.3 x 1.5: 1 -0.95,0; 2 0.95,0
TESTPOINT_PAD_2MM = smd 2 x 2: P$1 0,0
HVQFN40-6X6 = smd 1 x 0.25: 1 -2.99,2.25; 2 -2.99,1.75; 3 -2.99,1.25; 4 -2.99,0.75; 5 -2.99,0.25; 6 -2.99,-0.25; 7 -2.99,-0.75; 8 -2.99,-1.25; 9 -2.99,-1.75; 10 -2.99,-2.25; 21 2.99,-2.25; 22 2.99,-1.75; 23 2.99,-1.25; 24 2.99,-0.75; 25 2.99,-0.25; 26 2.99,0.25; 27 2.99,0.75; 28 2.99,1.25; 29 2.99,1.75; 30 2.99,2.25 | smd 0.25 x 1: 11 -2.25,-2.99; 12 -1.75,-2.99; 13 -1.25,-2.99; 14 -0.75,-2.99; 15 -0.25,-2.99; 16 0.25,-2.99; 17 0.75,-2.99; 18 1.25,-2.99; 19 1.75,-2.99; 20 2.25,-2.99; 31 2.25,2.99; 32 1.75,2.99; 33 1.25,2.99; 34 0.75,2.99; 35 0.25,2.99; 36 -0.25,2.99; 37 -0.75,2.99; 38 -1.25,2.99; 39 -1.75,2.99; 40 -2.25,2.99 | smd 4 x 4: TP 0,0
SOT23-5 = smd 0.55 x 1.2: 1 -0.95,-1.3; 2 0,-1.3; 3 0.95,-1.3; 4 0.95,1.3; 5 -0.95,1.3
RGB6LED = smd 1.778 x 0.914 bottom: 5I -5.9,5.04; 5O 105.9,4.94; DI -5.9,7.58; DO 105.9,7.48; GI -5.9,2.5; GO 105.9,2.4
TOUCH10CM = smd 0.305 x 0.152: P$1 2.4,0.2; P$2 12.6,0.2; P$3 22.9,0.2; P$4 33.2,0.2; P$5 43.5,0.2; P$6 53.8,0.2; P$7 64.1,0.2; P$8 74.4,0.2; P$9 84.7,0.2; P$10 94.9,0.2
QSOP24 = smd 0.45 x 1.5: 1 -2.223,-2.69; 2 -1.587,-2.69; 3 -0.953,-2.69; 4 -0.318,-2.69; 5 0.318,-2.69; 6 0.953,-2.69; 7 1.587,-2.69; 8 2.223,-2.69; 9 2.857,-2.69; 10 3.493,-2.69; 11 4.128,-2.69; 12 4.763,-2.69; 13 4.763,2.69; 14 4.128,2.69; 15 3.493,2.69; 16 2.857,2.69; 17 2.223,2.69; 18 1.587,2.69; 19 0.953,2.69; 20 0.318,2.69; 21 -0.318,2.69; 22 -0.953,2.69; 23 -1.587,2.69; 24 -2.223,2.69
SOT223 = smd 1.219 x 2.235: 1 -2.311,-3.099; 2 0,-3.099; 3 2.311,-3.099 | smd 3.6 x 2.2: 4 0,3.099
CRYSTAL_3.2X2.5 = smd 1.4 x 1.2: 1 -1.1,-0.8; 2 1.1,0.8; GND1 -1.1,0.8; GND2 1.1,-0.8

### Placement (x,y rotation side)
C1  178.85,73.92 180 bottom
C2  178.85,72.12 180 bottom
C3  70.69,88.78 0 bottom
C4  70.69,87 0 bottom
C5  84.91,19.68 90 bottom
C6  167.72,19.44 90 bottom
C7  227.74,122.05 0 bottom
C8  23.32,121.16 180 bottom
C9  102.2,90.89 180 bottom
C10  135.97,149.54 90 top
C11  135.97,154.74 90 top
C12  133.94,149.54 90 top
C13  133.94,154.74 90 top
C14  137.97,147.52 270 top
C15  137.97,156.82 270 top
C16  139.94,147.52 270 top
C17  139.94,156.82 270 top
C18  123.39,158.3 0 top
C19  116.16,161.8 180 top
C20  112.85,159.01 90 top
C21  126.44,161.09 0 top
C22  131.77,162 90 top
C23  109.04,155.38 90 top
C24  117.04,146.31 270 top
C25  122.96,148.08 180 top
C26  119.08,146.31 270 top
C27  116.28,141.99 270 top
C28  115.01,146.31 90 top
C29  123.06,144.03 0 top
C30  123.39,156.27 0 top
C31  132.03,149.54 270 top
C32  132.03,154.74 270 top
C33  116.75,133.79 0 top
C34  120.74,140.26 180 top
J1  77.43,95.83 180 bottom
J2  167.51,71.44 90 bottom
J3  90.73,72.95 90 bottom
J4  174.08,97.1 0 bottom
J5  82.68,67.95 0 bottom
JP6  124.67,169.35 0 top
L1  123.02,146.01 180 top
L2  126.31,157.54 270 top
L3  123.9,150.55 180 top
L4  123.9,153.6 180 top
Q1  176.18,91.02 0 bottom
Q2  82.26,74.28 180 bottom
R1  176.74,86.85 90 bottom
R2  126.44,163.37 180 top
R3  129.74,161.98 270 top
R4  77.46,74.93 0 bottom
R5  87.29,95.13 90 bottom
R6  122.25,77.98 270 bottom
R7  171.4,79.13 90 bottom
R8  171.4,82.81 270 bottom
R9  139.33,150.62 180 top
R10  139.3,153.94 0 top
TP1  129.74,148.92 180 top
TP3  129.74,155.12 180 top
TP4  142.8,153.96 180 top
TP5  142.8,150.58 180 top
U1  115.48,152.73 180 top
U2  120.34,136.67 0 top
U$1  184.42,21.2 60 top
U$2  16.31,107.9 300 top
U$3  175.99,28.4 60 top
U$4  27.31,110.92 300 top
U$5  180.1,80.13 0 bottom
U$6  70.38,80.51 180 bottom
U$7  98.88,84.21 180 bottom
Y1  116.16,158.88 180 top

### Tracks (layer width: path | path; a pad name or v marks a point on that pad's centre or on a via)
5.0V  (2 unrouted)
+3V3  (1 unrouted)
  Bottom 0.406: U$6.6 71.33,86.64 C4.1 C3.1 | U$5.6 | U$5.6 179.15,75.95 177.85,74.65 C1.1 C2.1 | U$5.6 179.15,78.87 177.94,80.08 R7.2 R8.2
  Bottom 0.813: J3.7 86.39,88.19 82.5,92.08 72.47,92.08 71.69,91.3 C3.1
  Bottom 1.016: C2.1 177.85,65.76 176.48,64.39 112.09,64.39 99.14,77.35 99.14,80.78 | J3.7 94.23,88.19 95.33,89.29 98.88,89.29 99.01,89.16 99.01,87.64 98.88,87.51 U$7.2
+5V  (2 unrouted)
  Bottom 0.254: C9.1 100.39,90.89 100.23,90.73
  Bottom 1.016: 100.23,90.73 101.3,89.67 101.19,89.57 U$7.3
  Bottom 1.27: U$1.5I 174.65,16.15 | 234.46,117.15 233.09,115.78 U$1.5O | U$2.5O 73.54,18.16 74.75,16.95 74.75,16.04 75.4,16.7 | U$2.5I 15.59,119.27 | 234.46,121.97 230.98,121.97 C7.+ | C8.+ 20.17,121.9 19.19,122.88 | J3.8 90.73,91.55 91.13,91.15 99.9,91.15 99.92,91.14 100.48,91.14 C9.1
  Bottom 2.54: 234.46,117.15 234.46,121.97 234.46,125.55 232.36,127.64 90.25,127.64 | 15.59,119.27 19.19,122.88 23.95,127.64 90.25,127.64 | C6.+ 167.31,16.7 85.08,16.7 | C5.+ 85.08,16.7 | 85.08,16.7 75.4,16.7 | 166.12,16.15 174.65,16.15 | 90.73,91.55 90.73,127.16 90.25,127.64
AVDD
  Top 0.254: U1.8 119.58,153.98 120.6,155 120.6,155.76 121.1,156.27 C30.1 C18.1 122.54,158.97 123,159.44 125.68,159.44 126.31,158.81 L2.1
BTN1  (via drill 0.35)
  Bottom 0.254: U$6.17 72.6,76.31 73.1,75.81 73.1,64.08 84.23,52.95 v93.23,52.95
BTN2  (via drill 0.35)
  Bottom 0.254: U$5.3 181.05,76.12 181.73,75.45 181.73,56.45 178.23,52.95 v157.23,52.95
GND  (via drill 0.35, 0.4)  (5 unrouted)
  Top 0.203: 118.94,150.48 U1.1 | v127.83,159.57 127.83,160.8 C21.2 | U1.3 118.96,151.48 119.83,150.6
  Top 0.254: C32.1 132.03,157.16 v131.91,157.28 | U1.7 120.49,153.48 120.86,153.85 | 120.86,153.85 122.01,155 124.04,155 124.29,155.25 124.29,156.22 C30.2 C18.2 | v120.85,153.98 120.85,153.87 120.86,153.85 | 121.25,161.09 121.25,161.85
  Bottom 0.254: v131.91,157.28 131.91,157.54
  other vias: 60.08,113 92.58,56.35 158.13,56.35 190.73,113.05 158.08,169.55 92.73,169.5 136.72,160.84 140.03,161.47 133.93,160.08 133.55,163.63
  pour Bottom: -3.61,226.95 242.39,226.95 249.76,219.59 249.76,151.9 258.01,143.64 258.01,39.5 212.8,-5.71 44.65,-5.71 4.4,34.55 -4.88,43.82 -4.88,220.6 -4.88,221.62 -4.88,222.13
  pour Top: 92.5,56.35 158.18,56.35 190.78,113.03 158.08,169.55 92.72,169.55 60.01,113
IRQ  (1 unrouted)
MISO  (1 unrouted)
N$1
  Top 3.5: 154.73,52.45 arc-90 158.73,48.45 arc-90 154.73,44.45 147.73,44.45 arc-90 143.73,48.45 arc-90 147.73,52.45 154.73,52.45
N$2  (via drill 0.35)
  Top 0.254: v176.83,30.75 176.85,30.75 U$3.P$1
  Bottom 0.254: U$5.2 181.69,76.59 182.32,75.96 182.32,44.34 176.83,38.85 v176.83,30.75
N$3  (via drill 0.35)
  Top 0.254: v181.83,39.55 181.97,39.41 U$3.P$2
  Bottom 0.254: U$5.1 182.32,76.64 182.72,76.24 182.72,41.54 181.83,40.65 v181.83,39.55
N$4  (via drill 0.35)
  Top 0.254: U$3.P$3 187.05,48.55 v187.03,48.55
  Bottom 0.254: U$5.24 187.03,82.82 v187.03,48.55
N$5  (via drill 0.35)
  Top 0.254: v192.33,57.65 192.42,57.56 U$3.P$4
  Bottom 0.254: U$5.23 181.69,83.61 182.02,83.94 190.33,83.94 192.03,82.25 192.03,57.95 v192.33,57.65
N$6  (via drill 0.35)
  Top 0.254: v197.63,66.65 197.63,66.23 U$3.P$5
  Bottom 0.254: U$5.22 181.05,83.78 181.63,84.35 191.83,84.35 197.63,78.55 v197.63,66.65
N$7  (via drill 0.35)
  Top 0.254: v202.73,75.65 v202.72,75.64 U$3.P$6
  Bottom 0.254: U$5.21 180.42,83.77 181.57,84.91 193.47,84.91 v202.73,75.65
N$8  (via drill 0.35)
  Top 0.254: v207.63,84.15 207.77,84.01 U$3.P$7
  Bottom 0.254: U$5.20 179.78,83.7 181.73,85.65 206.13,85.65 v207.63,84.15
N$9  (via drill 0.35)
  Top 0.254: v212.63,92.85 212.94,92.85 U$3.P$8
  Bottom 0.254: U$5.19 179.15,83.72 188.28,92.85 v212.63,92.85
N$10  (via drill 0.35)
  Top 0.254: v217.93,101.75 218.07,101.75 U$3.P$9
  Bottom 0.254: U$5.18 178.51,83.66 196.6,101.75 v217.93,101.75
N$11  (via drill 0.35)
  Top 0.152: v28.84,109 28.73,108.89 U$4.P$1
  Bottom 0.152: U$6.3 69.42,84.96 45.39,109 v28.84,109
N$12  (via drill 0.35)
  Top 0.152: v34.2,100.11 U$4.P$2
  Bottom 0.152: U$6.2 68.79,84.71 53.39,100.11 v34.2,100.11
N$13  (via drill 0.35)
  Top 0.152: v39.18,91.31 39.06,91.31 U$4.P$3
  Bottom 0.152: U$6.1 68.15,84.58 61.42,91.31 v39.18,91.31
N$14  (via drill 0.35)
  Top 0.152: v44.18,82.55 44.08,82.44 U$4.P$4
  Bottom 0.152: U$6.24 48.92,77.81 v44.18,82.55
N$15  (via drill 0.35)
  Top 0.152: v49.54,73.21 49.37,73.21 U$4.P$5
  Bottom 0.152: U$6.23 68.79,76.59 65.41,73.21 v49.54,73.21
N$16  (via drill 0.35)
  Top 0.152: v54.57,64.52 54.47,64.52 U$4.P$6
  Bottom 0.152: U$6.22 69.42,75.83 58.11,64.52 v54.57,64.52
N$17  (via drill 0.35)
  Top 0.152: v59.71,55.65 59.67,55.65 U$4.P$7
  Bottom 0.152: U$6.21 70.06,66 v59.71,55.65
N$18  (via drill 0.35)
  Top 0.152: v64.81,46.73 64.68,46.6 U$4.P$8
  Bottom 0.152: U$6.20 70.69,52.62 v64.81,46.73
N$19  (via drill 0.35)
  Top 0.152: v69.99,37.82 69.84,37.67 U$4.P$9
  Bottom 0.152: U$6.19 71.33,39.15 v69.99,37.82
N$20  (via drill 0.35)
  Top 0.152: v75.05,29.08 75.05,28.95 U$4.P$10
  Bottom 0.152: U$6.18 71.96,33.96 75.05,30.88 v75.05,29.08
N$21
  Bottom 0.152: U$5.12 171.65,77.44 | 171.65,77.44 123.74,77.44 123.33,77.03 R6.2 | R7.1 171.65,77.92 171.65,77.44
N$22
  Bottom 0.152: U$6.11 74.5,83.96 74.88,84.33 76.02,84.33 76.66,83.7 85.17,83.7 85.8,83.06 90.68,83.06 J3.5
N$23
  Bottom 0.152: 13.95,111.89 22.72,117 77.33,22.3 68.62,17.11 13.92,111.89
N$24
  Bottom 0.254: U$1.DI 173.56,18.53 77.14,18.53 U$2.DO
N$25
  Bottom 0.254: U$5.16 177.24,85.39 R1.1
N$26
  Bottom 0.254: U$6.16 73.23,76.89 75.2,74.93 R4.2
N$27
  Bottom 0.254: R4.1 78.76,75.28 Q2.1
N$28
  Bottom 0.254: Q2.3 82.26,68.37 J5.P$2
N$29
  Bottom 0.254: U$2.DI 19.92,117.45 23.18,120.7 23.18,122.55 24.73,124.1 86.28,124.1 87.53,122.85 87.53,96.4 87.38,96.25 87.38,96.17 R5.2
N$30
  Bottom 0.254: R5.1 87.29,93.56 86.78,93.05 86.78,89.9 87.33,89.35 93.83,89.35 94.68,90.2 99.33,90.2 99.93,89.6 99.93,85.85 99.63,85.55 90.83,85.55 J3.6
N$31
  Bottom 0.152: U$6.14 74.5,79.01 74.75,79.25 86.06,79.25 87.33,77.98 90.68,77.98 J3.3 91.31,78.03 91.39,78.11 91.52,77.98 94.18,77.98 96.17,79.97 96.17,82.68 96.85,83.37 103.71,83.37 109.09,77.98 164.8,77.98 170.77,83.95 171.53,83.95 | U$5.14 175.97,83.7 175.72,83.95 171.53,83.95 | R8.1 171.4,83.83 171.53,83.95
N$32
  Bottom 0.152: U$6.12 84.91,83.2 87.58,80.52 90.68,80.52 J3.4 94.74,80.57 95.86,81.69 95.86,82.81 96.73,83.67 103.84,83.67 107.08,80.43 120.76,80.43 R6.1
N$33
  Bottom 0.152: 173.36,22.25 182.14,17.09 236.84,111.86 228.06,116.9 173.36,22.25
N$34
  Bottom 0.152: U$5.11 175.97,76.33 175.72,76.08 173.81,76.08 173.18,76.71 125.05,76.71 123.78,75.44 111.2,75.44 103.58,83.06 96.98,83.06 96.47,82.56 96.47,76.08 95.84,75.44 90.77,75.44 J3.2
N$35
  Bottom 0.254: Q1.3 176.18,95 J4.P$2
N$36
  Bottom 0.152: U$5.9 177.24,76.44 176.64,75.84 176.64,72.56 175.34,71.25 175.15,71.44 J2.2
N$37
  Bottom 0.152: U$5.10 176.61,76.35 174.74,74.48 J2.3
N$38
  Bottom 0.152: U$6.9 73.23,84.14 74.88,85.78 74.93,85.78 75.01,85.86 76.79,85.86 77.43,86.5 J1.2
N$39
  Bottom 0.152: U$6.10 73.87,84.34 75.01,85.48 79.33,85.48 79.97,86.12 J1.3
N$40
  Bottom 0.254: Q1.1 177.13,89.62 176.74,89.23 R1.2
N$41
  Top 3.5: 102.73,52.45 arc-90 106.73,48.45 arc-90 102.73,44.45 95.73,44.45 arc-90 91.73,48.45 arc-90 95.73,52.45 102.73,52.45
N$42
  Bottom 0.076: 147.73,50.95 arc90 145.23,48.45 arc90 147.73,45.95 154.73,45.95 arc90 157.23,48.45 arc90 154.73,50.95 147.73,50.95
N$43
  Bottom 0.076: 95.73,50.95 arc90 93.23,48.45 arc90 95.73,45.95 102.73,45.95 arc90 105.23,48.45 arc90 102.73,50.95 95.73,50.95
N$44
  Top 0.203: U1.4 119.04,151.98 120.47,150.55 L3.2
N$45
  Top 0.203: U1.6 121.63,152.98 122.25,153.6 L4.2
N$46
  Top 0.203: C10.2 C12.2 | 130.29,149.45 129.74,149.45 129.74,149.53
  Top 0.406: TP1.P$1 130.29,148.96 130.29,149.45 131.39,150.55 132.45,150.55 C31.1 C10.2 | L3.1 125.39,150.48 128.03,150.48 128.85,149.66 129.61,149.66 129.74,149.53
N$47  (1 unrouted)
  Top 0.152: U1.14 116.23,157.03 116.16,157.1 116.16,158.88 116.96,159.68 Y1.1
N$48  (2 unrouted)
N$49  (via drill 0.4)
  Top 0.203: U1.9 119.32,154.48 119.83,155 119.83,157.79 123.13,161.09 C21.1 | C21.1 125.42,161.09 | v123.88,163.37 R2.2 | v123.85,160.27 124.92,160.27 C21.1
  Bottom 0.203: v123.85,160.27 123.85,163.1 v123.88,163.37
N$50
  Top 0.203: U1.10 119.05,154.98 119.33,155.25 119.33,158.04 123.51,162.23 126.56,162.23 127.45,163.12 R2.1
  Top 0.254: 127.58,163.87 127.98,164.27 131.79,164.27 131.79,162.93 | 131.79,162.93 131.79,162.87 | 131.79,162.93 C22.2
  Top 0.305: R2.1 127.58,163.87
N$51
  Top 0.254: C22.1 131.79,161.03 131.79,160.96 129.88,162.87
  Top 0.305: 129.88,162.87 129.82,162.93 R3.1
N$52  (1 unrouted)
  Top 0.203: L4.1 124.91,153.66
  Top 0.406: C11.1 C13.1 C32.2 131.97,153.73 131.15,153.73 129.75,155.12 TP3.P$1 129.23,154.61 128.98,154.61 127.96,153.6 L4.1
N$53
  Top 0.356: 143.69,149.7 TP5.P$1
  Top 0.406: TP5.P$1 140.32,150.58 R9.1
N$54
  Top 0.356: 143.69,154.85 TP4.P$1
  Top 0.406: TP4.P$1 142.79,153.94 R10.2
N$56  (1 unrouted)
  Top 0.203: U1.5 119.56,152.48 119.92,152.11 119.96,152.07
  Top 0.406: 119.92,152.11 123.69,152.11 123.9,151.9 123.9,148.09 C25.1
N$83  (1 unrouted)
N$84  (1 unrouted)
T1  (via drill 0.35)
  Top 0.254: v222.73,110.65 223.24,110.65 U$3.P$10
  Bottom 0.254: U$5.17 177.88,84 204.53,110.65 v222.73,110.65
TX1_ANTENNA
  Top 0.203: C16.1 C14.1 C10.1 C12.1
  Top 0.406: C16.1 139.95,148.49 138.02,148.49 138.38,149.11 R9.2
TX2_ANTENNA
  Top 0.203: C17.2 C15.2 C11.2 C13.2
  Top 0.406: C17.2 140.43,155.69 140.25,155.87 | 140.25,155.87 140.18,155.94 | 140.25,155.87 R10.1
VCC  (via drill 0.4)  (4 unrouted)
  Top 0.254: L2.2 126.31,155.39 v126.33,155.38
VDD  (5 unrouted)
(copper drawn outside any net)
  shapes: Top area x2080

### Text on the board
tPlace: C15 | RX | C4 | TX2 | C6 | C2 | C8 | C10 | TX2 | L4 | R4 | L3 | TX1 | R3 | C5 | C1 | C7 | C9 | C3 | TX1
bNames: JLCJLCJLCJLC
200bmp: C:/Users/Gip/Documents/Cartender/Wallbox/Vetro davanti/cartender.bmp